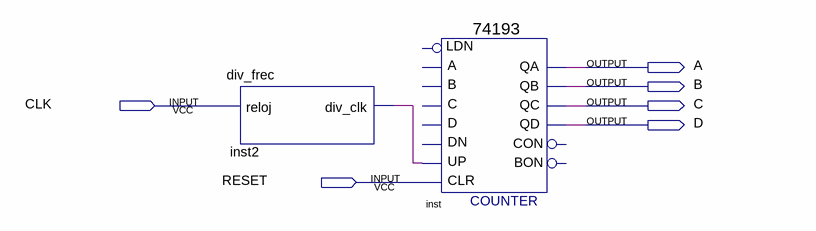
[diagram p0: schematic sheet]
// Quartus schematic Practica1.bdf as structural Verilog: 2 symbols, 6 pins
module Practica1 (
  input  CLK,
  input  RESET,
  output A,
  output B,
  output C,
  output D
);

  wire inst2_div_clk;

  div_frec inst2 (.reloj(CLK), .div_clk(inst2_div_clk));
  \74193  inst (
    .CLR(RESET), .UP(inst2_div_clk), .QB(B), .QA(A), .QD(D), .QC(C));  // open: D, C, B, A, DN, LDN, CON, BON
endmodule
